# Altium schematic sheet MicroSD.SchDoc
size B; SheetNumber: 3; SheetTotal: 4
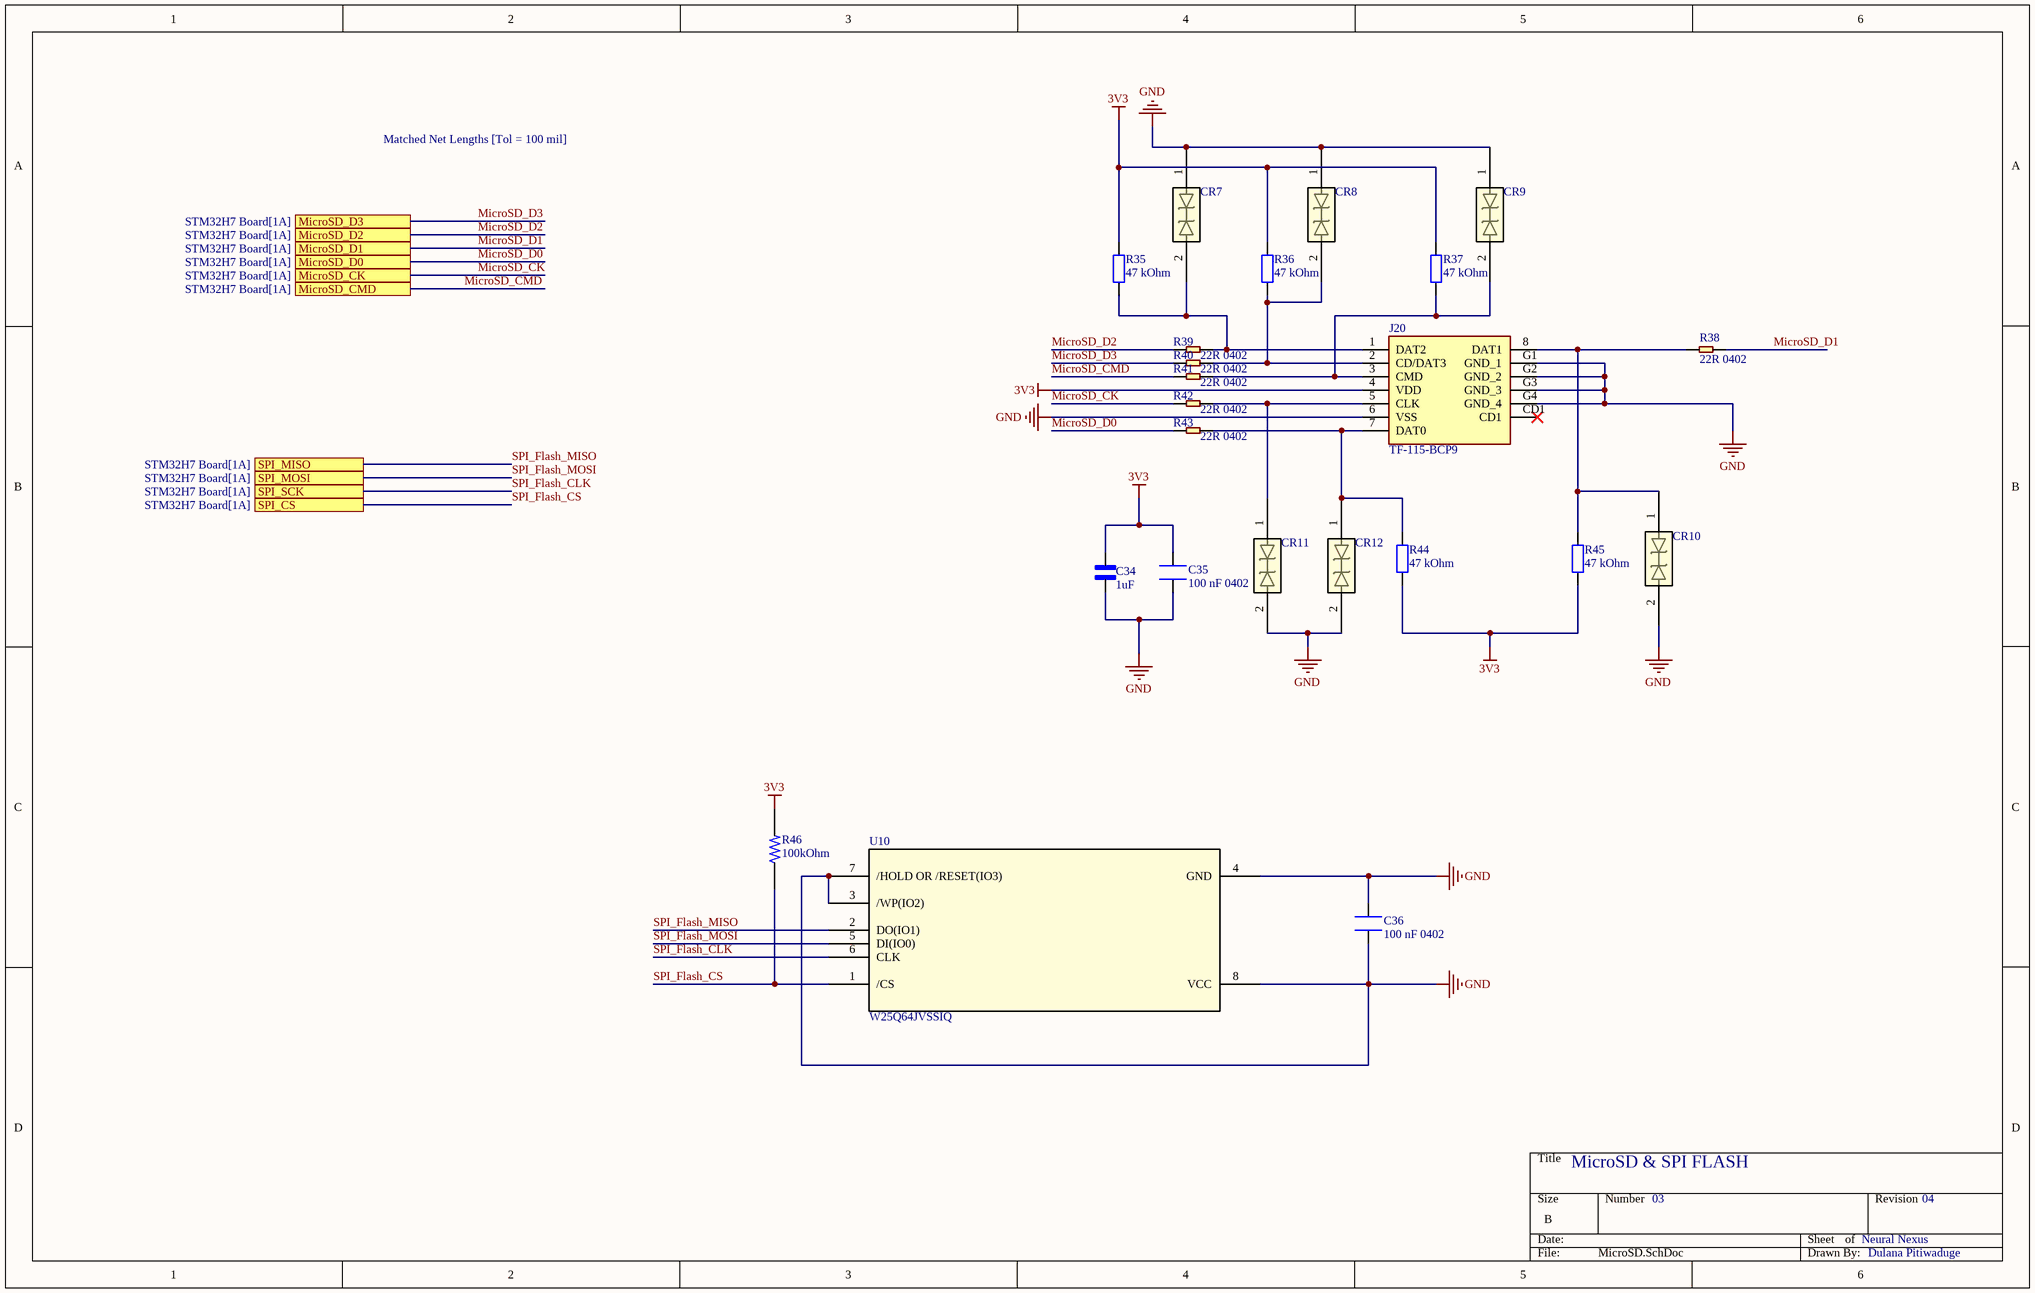
[diagram p0: MicroSD.SchDoc]

## Parts
C34  1uF  [CAPC1005X55N]
C35  100 nF 0402  [CAPC1005X55N]
C36  100 nF 0402  [CAPC1005X55N]
CR7  SP0402B-ULC-01ETG  [SP0402_LTF]  (value not drawn)
CR8  SP0402B-ULC-01ETG  [SP0402_LTF]  (value not drawn)
CR9  SP0402B-ULC-01ETG  [SP0402_LTF]  (value not drawn)
CR10  SP0402B-ULC-01ETG  [SP0402_LTF]  (value not drawn)
CR11  SP0402B-ULC-01ETG  [SP0402_LTF]  (value not drawn)
CR12  SP0402B-ULC-01ETG  [SP0402_LTF]  (value not drawn)
J20  TF-115-BCP9  [TF115BCP9]
R35  47 kOhm  [RESC1608X55]
R36  47 kOhm  [RESC1608X55]
R37  47 kOhm  [RESC1608X55]
R38  22R 0402  [R0402]
R39  22R 0402  [R0402]
R40  22R 0402  [R0402]
R41  22R 0402  [R0402]
R42  22R 0402  [R0402]
R43  22R 0402  [R0402]
R44  47 kOhm  [RESC1608X55]
R45  47 kOhm  [RESC1608X55]
R46  100kOhm  [RESC1607X60N]
U10  W25Q64JVSSIQ  [SOIC-8_5P28X5P28_WIN]

## Ports
MicroSD_CK (see STM32H7 Board[1A]), MicroSD_CMD (see STM32H7 Board[1A]), MicroSD_D0 (see STM32H7 Board[1A]), MicroSD_D1 (see STM32H7 Board[1A]), MicroSD_D2 (see STM32H7 Board[1A]), MicroSD_D3 (see STM32H7 Board[1A]), SPI_CS (see STM32H7 Board[1A]), SPI_MISO (see STM32H7 Board[1A]), SPI_MOSI (see STM32H7 Board[1A]), SPI_SCK (see STM32H7 Board[1A])

## Nets
3V3: C34.2 C35.2 J20.4(VDD) R35.2 R36.2 R37.2 R44.1 R45.1 R46.2
GND: C34.1 C35.1 C36.1 C36.2 CR7.1 CR8.1 CR9.1 CR10.2 CR11.2 CR12.2 J20.6(VSS) J20.G1(GND_1) J20.G2(GND_2) J20.G3(GND_3) J20.G4(GND_4) U10.3(/WP(IO2)) U10.4(GND) U10.7(/HOLD_OR_/RESET(IO3)) U10.8(VCC)
MicroSD_CK: R42.1 ; port MicroSD_CK
MicroSD_CMD: R41.1 ; port MicroSD_CMD
MicroSD_D0: R43.1 ; port MicroSD_D0
MicroSD_D1: R38.2 ; port MicroSD_D1
MicroSD_D2: R39.1 ; port MicroSD_D2
MicroSD_D3: R40.1 ; port MicroSD_D3
SPI_Flash_CLK: U10.6(CLK) ; port SPI_SCK
SPI_Flash_CS: R46.1 U10.1(/CS) ; port SPI_CS
SPI_Flash_MISO: U10.2(DO(IO1)) ; port SPI_MISO
SPI_Flash_MOSI: U10.5(DI(IO0)) ; port SPI_MOSI
NetCR7_2: CR7.2 J20.1(DAT2) R35.1 R39.2
NetCR8_2: CR8.2 J20.2(CD/DAT3) R36.1 R40.2
NetCR9_2: CR9.2 J20.3(CMD) R37.1 R41.2
NetCR10_1: CR10.1 J20.8(DAT1) R38.1 R45.2
NetCR11_1: CR11.1 J20.5(CLK) R42.2
NetCR12_1: CR12.1 J20.7(DAT0) R43.2 R44.2

Not connected (* = marked no-connect by the designer): J20 CD1*

## Notes on the sheet
- Matched Net Lengths [Tol = 100 mil]
- MicroSD & SPI FLASH
- 03
- Neural Nexus
- 04
- Dulana Pitiwaduge

## Library data of the parts
C34 = JMK105BJ105KV-F: 1 ÂµF Â±10% 6.3V Ceramic Capacitor X5R 0402 (1005 Metric); MF: Taiyo Yuden; SnapEDA_Link: https://www.snapeda.com/parts/JMK105BJ105KV-F/Taiyo+Yuden/view-part/?ref=snap; Package: 1005 Taiyo Yuden; Value: *; MP: JMK105BJ105KV-F; Check_prices: https://www.snapeda.com/parts/JMK105BJ105KV-F/Taiyo+Yuden/view-part/?ref=eda
C35 C36 = CL05B104KP5NNNC: 0.1 ÂµF Â±10% 10V Ceramic Capacitor X7R 0402 (1005 Metric); MF: Samsung Electro-Mechanics; SnapEDA_Link: https://www.snapeda.com/parts/CL05B104KP5NNNC/Samsung/view-part/?ref=snap; Package: SMD-2 Samsung; Value: *; MP: CL05B104KP5NNNC; Check_prices: https://www.snapeda.com/parts/CL05B104KP5NNNC/Samsung/view-part/?ref=eda
CR7-CR12 = SP0402B-ULC-01ETG: Description; Manufacturer_Name: Littelfuse Inc; Copyright: Copyright (C) 2025 Ultra Librarian. All rights reserved.; Manufacturer_Part_Number: SP0402B-ULC-01ETG; RefDes: RefDes; Type: Type
J20 = TF-115-BCP9: -25~+85 1.8mm Tin Deck MicroSD card (TF card) 260 C5191 Self bomb SMD SD Card Connectors ROHS; Manufacturer_Name: XUNPU; Geometry.Height: 2mm; Manufacturer_Part_Number: TF-115-BCP9; Mouser Part Number: *; Mouser Price/Stock: *; Arrow Part Number: *; Arrow Price/Stock: *; Datasheet Link: https://datasheet.lcsc.com/lcsc/2109061830_XUNPU-TF-115-BCP9_C720505.pdf
R35-R37 R44 R45 = RC0603FR-0747KL: 47 kOhms Â±1% 0.1W, 1/10W Chip Resistor 0603 (1608 Metric) Moisture Resistant Thick Film; MF: Yageo; SnapEDA_Link: https://www.snapeda.com/parts/RC0603FR-0747KL/Yageo/view-part/?ref=snap; Package: SMD-2 Yageo; Value: *; MP: RC0603FR-0747KL; Check_prices: https://www.snapeda.com/parts/RC0603FR-0747KL/Yageo/view-part/?ref=eda; LCSC Part Number: *
R38-R43 = SMD-RES-22R-1%-1/16W(0402): 22 Ohms Â±1% 0.063W, 1/16W Chip Resistor 0402 (1005 Metric) Moisture Resistant Thick Film; MF: Yageo; MP: RC0402FR-0722RL; SnapEDA_Link: https://www.snapeda.com/parts/RC0402FR-0722RL/Yageo/view-part/?ref=snap; Package: 0402 Yageo; Value: *; Check_prices: https://www.snapeda.com/parts/RC0402FR-0722RL/Yageo/view-part/?ref=eda
R46 = RC0603FR-07100KL: 100 kOhms Â±1% 0.1W, 1/10W Chip Resistor 0603 (1608 Metric) Moisture Resistant Thick Film; MF: Yageo; SnapEDA_Link: https://www.snapeda.com/parts/RC0603FR-07100KL/Yageo/view-part/?ref=snap; Package: 0603 Yageo; Value: *; MP: RC0603FR-07100KL; Check_prices: https://www.snapeda.com/parts/RC0603FR-07100KL/Yageo/view-part/?ref=eda
U10 = W25Q64JVSSIQ: IC FLASH 64MBIT SPI/QUAD 8SOIC; Manufacturer_Name: Winbond; Copyright: Copyright (C) 2025 Ultra Librarian. All rights reserved.; Manufacturer_Part_Number: W25Q64JVSSIQ; RefDes: RefDes; Type: Type